# Altium schematic sheet MPU_12x12.SchDoc: MPU_12x12
size A3; DocumentNumber: MB1272; Revision: A-01; SheetNumber: 3; SheetTotal: 15; Project: STM32MP15-DISCO PI; ProjectName: MB1272
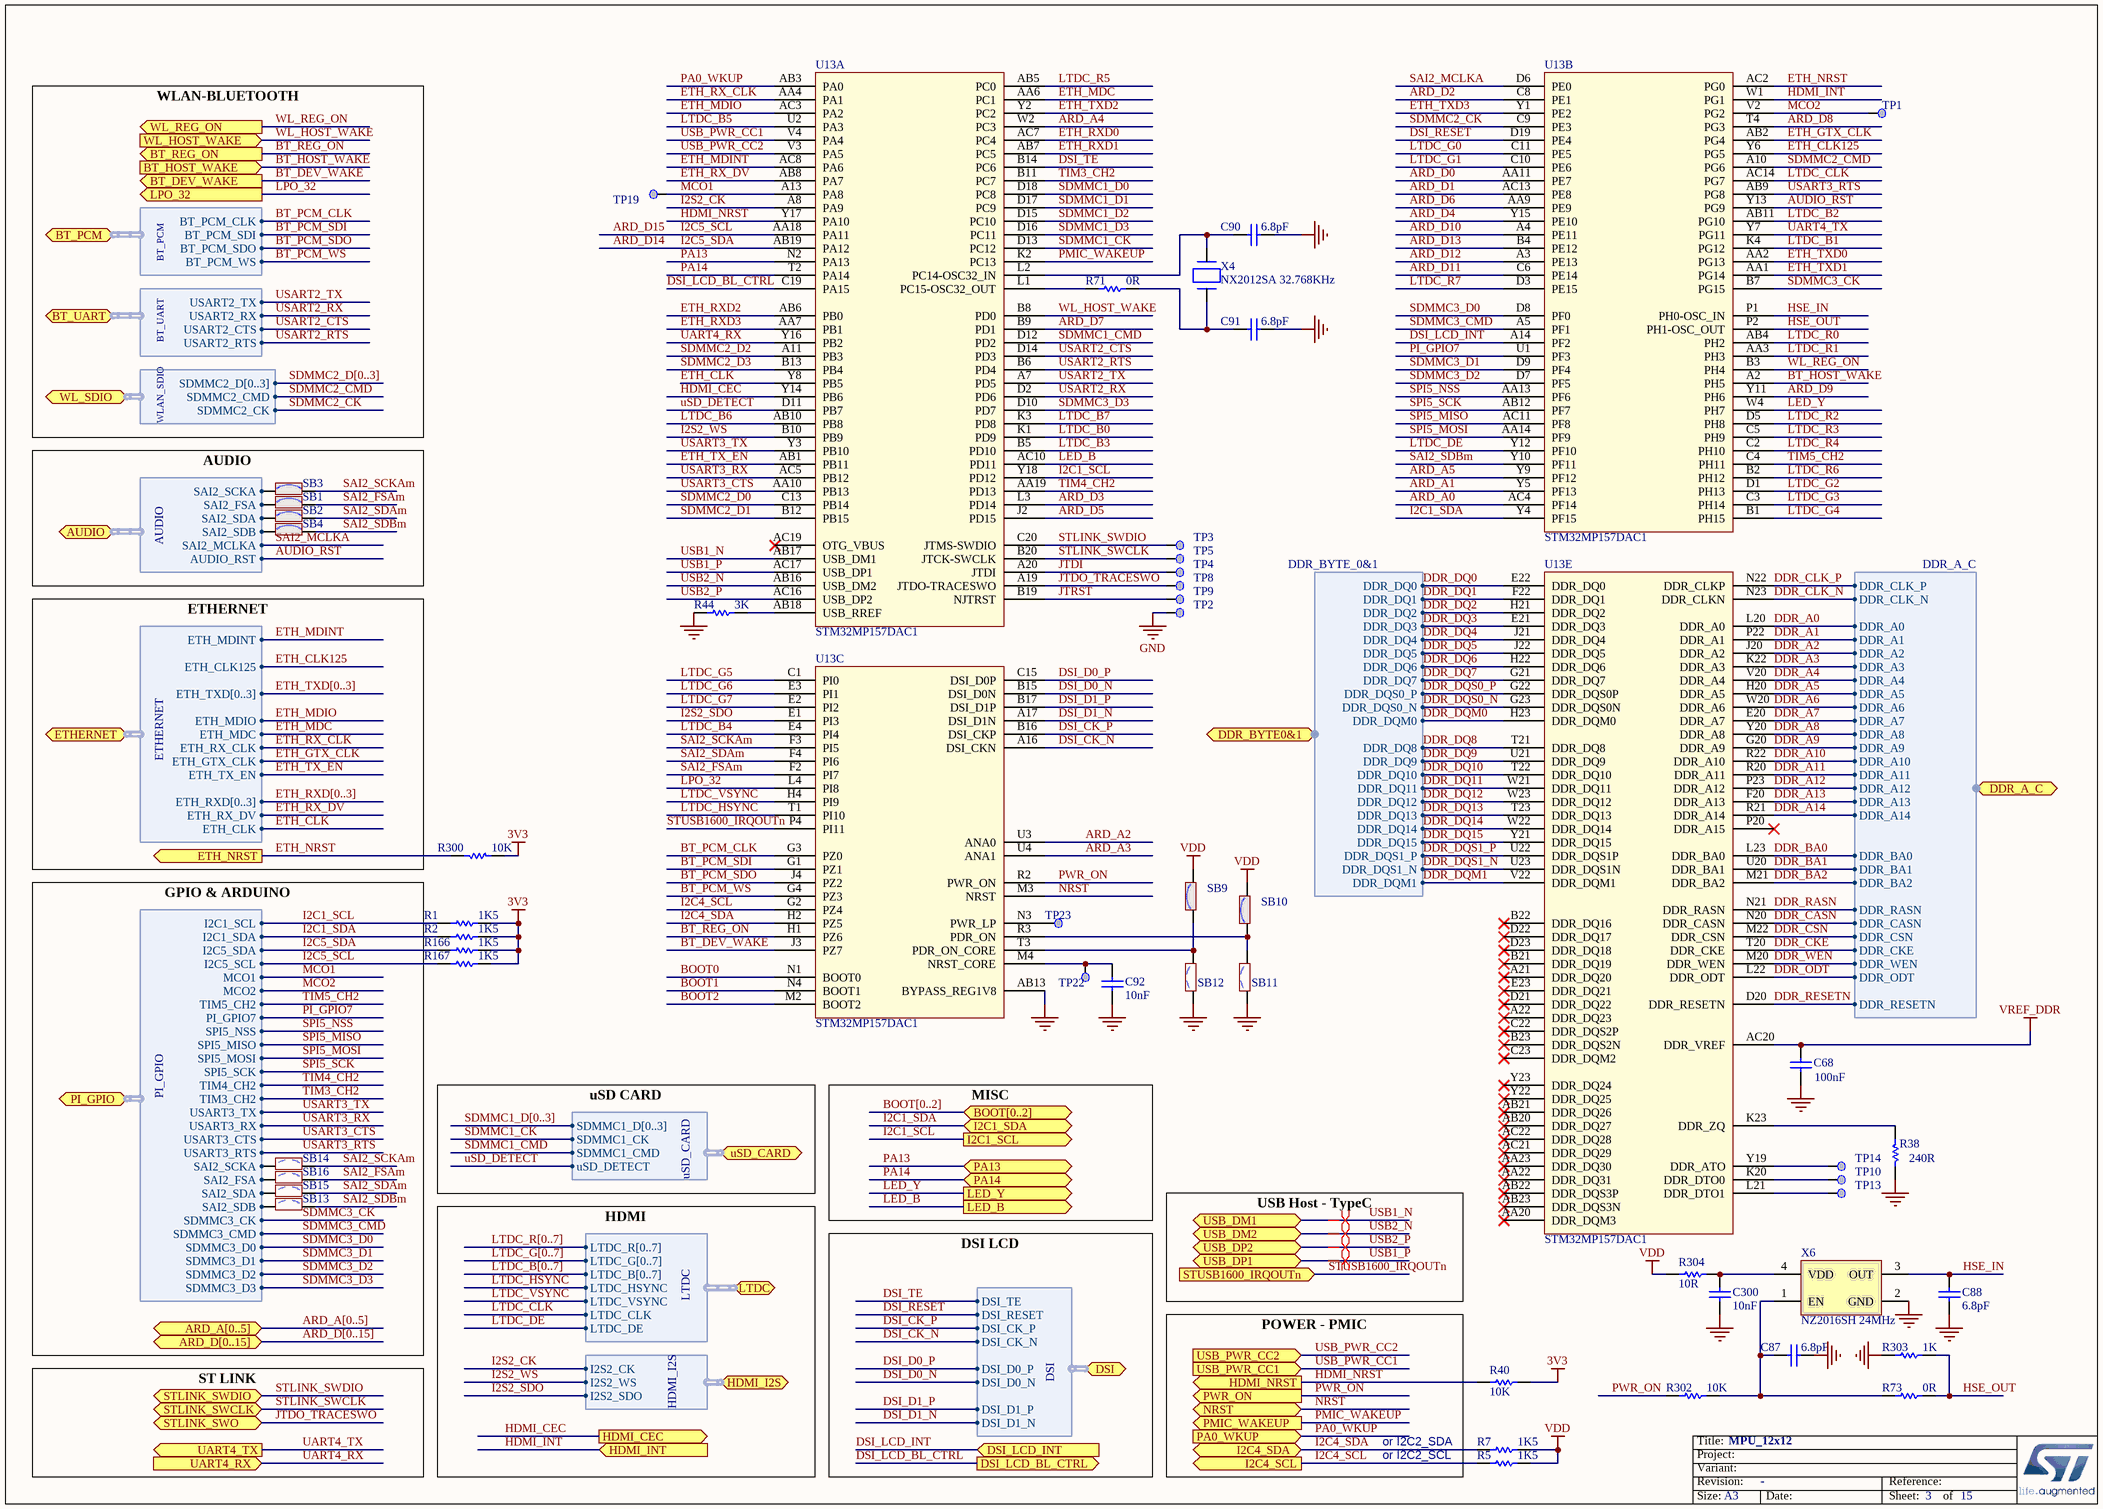
[diagram p0: MPU_12x12.SchDoc]

## Parts
C68  value 100nF  [C0402]
C87  value 6.8pF  [C0402]  (hidden comment: Capacitor)
C88  value 6.8pF  [C0402]  (hidden comment: Capacitor)
C90  value 6.8pF  [C0402]  (hidden comment: Capacitor)
C91  value 6.8pF  [C0402]  (hidden comment: Capacitor)
C92  value 10nF  [C0402]  (hidden comment: Capacitor)
C300  value 10nF  [C0402]  (hidden comment: Capacitor)
R1  value 1K5  [R0402]
R2  value 1K5  [R0402]
R5  value 1K5  [R0402]
R7  value 1K5  [R0402]
R38  value 240R  [R0402]
R40  value 10K  [R0402]  (hidden comment: Resistor)
R44  value 3K  [R0402]
R71  value 0R  [R0402]
R73  value 0R  [R0402]
R166  value 1K5  [R0402]
R167  value 1K5  [R0402]
R300  value 10K  [R0402]  (hidden comment: Resistor)
R302  value 10K  [R0402]  (hidden comment: Resistor)
R303  value 1K  [R0402]
R304  value 10R  [R0402]  (hidden comment: Resistor)
SB1  (no value)  [SOLDER-BRIDGE_R0603-0R]
SB2  (no value)  [SOLDER-BRIDGE_R0603-0R]
SB3  (no value)  [SOLDER-BRIDGE_R0603-0R]
SB4  (no value)  [SOLDER-BRIDGE_R0603-0R]
SB9  (no value)  [SOLDER-BRIDGE_R0603-0R]
SB10  (no value)  [SOLDER-BRIDGE_R0603-0R]
SB11  (no value)  [SOLDER-BRIDGE_R0603-0R]
SB12  (no value)  [SOLDER-BRIDGE_R0603-0R]
SB13  (no value)  [SOLDER-BRIDGE_R0603-0R]
SB14  (no value)  [SOLDER-BRIDGE_R0603-0R]
SB15  (no value)  [SOLDER-BRIDGE_R0603-0R]
SB16  (no value)  [SOLDER-BRIDGE_R0603-0R]
TP1  Test Point  [TP_SMD_1MM]  (value not drawn)  (no BOM)
TP2  Test Point  [TP_SMD_1MM]  (value not drawn)  (no BOM)
TP3  Test Point  [TP_SMD_1MM]  (value not drawn)  (no BOM)
TP4  Test Point  [TP_SMD_1MM]  (value not drawn)  (no BOM)
TP5  Test Point  [TP_SMD_1MM]  (value not drawn)  (no BOM)
TP8  Test Point  [TP_SMD_1MM]  (value not drawn)  (no BOM)
TP9  Test Point  [TP_SMD_1MM]  (value not drawn)  (no BOM)
TP10  (no value)  [TP_SMD_0-6MM]
TP13  (no value)  [TP_SMD_0-6MM]
TP14  (no value)  [TP_SMD_0-6MM]
TP19  Test Point  [TP_SMD_1MM]  (value not drawn)  (no BOM)
TP22  Test Point  [TP_SMD_1MM]  (value not drawn)  (no BOM)
TP23  Test Point  [TP_SMD_1MM]  (value not drawn)  (no BOM)
U13  value STM32MP157DAC1  [ICC_TFBGA361_12X12_STM32MP157CAC3_P050-065]  (parts A,B,C,E of 5)
X4  value NX2012SA 32.768KHz  [CRY_NX2012SA_2P]  (hidden comment: XTAL_2_PINS)
X6  value NZ2016SH 24MHz  [CRY_NZ2016SH_4P]  (hidden comment: OSCILLATOR_4_PINS)

## Ports
ARD_A[0..5], ARD_D[0..15], AUDIO (harness AUDIO), BOOT[0..2], BT_DEV_WAKE (out), BT_HOST_WAKE (in), BT_PCM (harness BT_PCM), BT_REG_ON (out), BT_UART (harness BT_UART), DDR_A_C (harness DDR_A_C), DDR_BYTE0&1 (harness DDR_BYTE_0&1), DSI (harness DSI), DSI_LCD_BL_CTRL (out), DSI_LCD_INT (in), ETH_NRST (out), ETHERNET (harness ETHERNET), HDMI_CEC (out), HDMI_I2S (harness HDMI_I2S), HDMI_INT (in), HDMI_NRST (out), I2C1_SCL (out), I2C1_SDA (bidir), I2C4_SCL (out), I2C4_SDA (bidir), LED_B (out), LED_Y (out), LPO_32 (out), LTDC (harness LTDC), NRST (bidir), PA0_WKUP (in), PA13, PA14, PI_GPIO (harness PI_GPIO), PMIC_WAKEUP (out), PWR_ON (out), STLINK_SWCLK, STLINK_SWDIO, STLINK_SWO, STUSB1600_IRQOUTn (in), UART4_RX (in), UART4_TX (out), USB_DM1 (bidir), USB_DM2 (bidir), USB_DP1 (bidir), USB_DP2 (bidir), USB_PWR_CC1 (in), USB_PWR_CC2 (in), uSD_CARD (harness uSD_CARD), WL_HOST_WAKE (in), WL_REG_ON (out), WL_SDIO (harness WLAN_SDIO)

## Harnesses
DDR_BYTE_0&1: DDR_DQ0, DDR_DQ1, DDR_DQ2, DDR_DQ3, DDR_DQ4, DDR_DQ5, DDR_DQ6, DDR_DQ7, DDR_DQS0_P, DDR_DQS0_N, DDR_DQM0, DDR_DQ8, DDR_DQ9, DDR_DQ10, DDR_DQ11, DDR_DQ12, DDR_DQ13, DDR_DQ14, DDR_DQ15, DDR_DQS1_P, DDR_DQS1_N, DDR_DQM1
DDR_A_C: DDR_CLK_P, DDR_CLK_N, DDR_A0, DDR_A1, DDR_A2, DDR_A3, DDR_A4, DDR_A5, DDR_A6, DDR_A7, DDR_A8, DDR_A9, DDR_A10, DDR_A11, DDR_A12, DDR_A13, DDR_A14, DDR_BA0, DDR_BA1, DDR_BA2, DDR_RASN, DDR_CASN, DDR_CSN, DDR_CKE, DDR_WEN, DDR_ODT, DDR_RESETN
PI_GPIO: I2C1_SCL, I2C1_SDA, I2C5_SDA, MCO1, MCO2, TIM5_CH2, PI_GPIO7, SPI5_NSS, SPI5_MISO, SPI5_MOSI, SPI5_SCK, TIM4_CH2, TIM3_CH2, USART3_TX, USART3_RX, USART3_CTS, USART3_RTS, SDMMC3_CK, SDMMC3_CMD, SDMMC3_D0, SDMMC3_D1, SDMMC3_D2, SDMMC3_D3, I2C5_SCL, SAI2_SCKA, SAI2_FSA, SAI2_SDA, SAI2_SDB
ETHERNET: ETH_MDINT, ETH_CLK125, ETH_TXD[0..3], ETH_MDIO, ETH_MDC, ETH_RX_CLK, ETH_GTX_CLK, ETH_TX_EN, ETH_RXD[0..3], ETH_RX_DV, ETH_CLK
AUDIO: SAI2_SCKA, SAI2_FSA, SAI2_SDA, SAI2_SDB, SAI2_MCLKA, AUDIO_RST
LTDC: LTDC_R[0..7], LTDC_G[0..7], LTDC_B[0..7], LTDC_HSYNC, LTDC_VSYNC, LTDC_CLK, LTDC_DE
uSD_CARD: SDMMC1_D[0..3], SDMMC1_CK, SDMMC1_CMD, uSD_DETECT
BT_PCM: BT_PCM_CLK, BT_PCM_SDI, BT_PCM_SDO, BT_PCM_WS
BT_UART: USART2_TX, USART2_RX, USART2_CTS, USART2_RTS
WLAN_SDIO: SDMMC2_D[0..3], SDMMC2_CMD, SDMMC2_CK
HDMI_I2S: I2S2_CK, I2S2_SDO, I2S2_WS
DSI: DSI_CK_P, DSI_CK_N, DSI_D0_P, DSI_D0_N, DSI_D1_P, DSI_D1_N, DSI_TE, DSI_RESET

## Nets
3V3: R1.1 R2.1 R40.1 R166.1 R167.1 R300.1
GND: C68.1 C87.2 C88.1 C90.2 C91.2 C92.1 C300.1 R38.2 R44.1 R303.2 SB11.1 SB12.1 TP2.1 U13.AB13(BYPASS_REG1V8) X6.2(GND)
VDD: R5.1 R7.1 R304.1 SB9.2 SB10.2
VREF_DDR: C68.2 U13.AC20(DDR_VREF)
ARD_A0: U13.AC4(PF14)
ARD_A1: U13.Y5(PF13)
ARD_A2: U13.U3(ANA0)
ARD_A3: U13.U4(ANA1)
ARD_A4: U13.W2(PC3)
ARD_A5: U13.Y9(PF12)
ARD_D0: U13.AA11(PE7)
ARD_D1: U13.AC13(PE8)
ARD_D2: U13.C8(PE1)
ARD_D3: U13.L3(PD14)
ARD_D4: U13.Y15(PE10)
ARD_D5: U13.J2(PD15)
ARD_D6: U13.AA9(PE9)
ARD_D7: U13.B9(PD1)
ARD_D8: U13.T4(PG3)
ARD_D9: U13.Y11(PH6)
ARD_D10: U13.A4(PE11)
ARD_D11: U13.C6(PE14)
ARD_D12: U13.A3(PE13)
ARD_D13: U13.B4(PE12)
ARD_D14: R166.2 U13.AB19(PA12) ; port PI_GPIO.I2C5_SDA  [also labelled I2C5_SDA]
ARD_D15: R167.2 U13.AA18(PA11) ; port PI_GPIO.I2C5_SCL  [also labelled I2C5_SCL]
AUDIO_RST: U13.Y13(PG9) ; port AUDIO.AUDIO_RST
BOOT0: U13.N1(BOOT0)
BOOT1: U13.N4(BOOT1)
BOOT2: U13.M2(BOOT2)
BT_DEV_WAKE: U13.J3(PZ7) ; port BT_DEV_WAKE
BT_HOST_WAKE: U13.A2(PH5) ; port BT_HOST_WAKE
BT_PCM_CLK: U13.G3(PZ0) ; port BT_PCM.BT_PCM_CLK
BT_PCM_SDI: U13.G1(PZ1) ; port BT_PCM.BT_PCM_SDI
BT_PCM_SDO: U13.J4(PZ2) ; port BT_PCM.BT_PCM_SDO
BT_PCM_WS: U13.G4(PZ3) ; port BT_PCM.BT_PCM_WS
BT_REG_ON: U13.H1(PZ6) ; port BT_REG_ON
DDR_A0: U13.L20(DDR_A0) ; port DDR_A_C.DDR_A0
DDR_A1: U13.P22(DDR_A1) ; port DDR_A_C.DDR_A1
DDR_A2: U13.J20(DDR_A2) ; port DDR_A_C.DDR_A2
DDR_A3: U13.K22(DDR_A3) ; port DDR_A_C.DDR_A3
DDR_A4: U13.V20(DDR_A4) ; port DDR_A_C.DDR_A4
DDR_A5: U13.H20(DDR_A5) ; port DDR_A_C.DDR_A5
DDR_A6: U13.W20(DDR_A6) ; port DDR_A_C.DDR_A6
DDR_A7: U13.E20(DDR_A7) ; port DDR_A_C.DDR_A7
DDR_A8: U13.Y20(DDR_A8) ; port DDR_A_C.DDR_A8
DDR_A9: U13.G20(DDR_A9) ; port DDR_A_C.DDR_A9
DDR_A10: U13.R22(DDR_A10) ; port DDR_A_C.DDR_A10
DDR_A11: U13.R20(DDR_A11) ; port DDR_A_C.DDR_A11
DDR_A12: U13.P23(DDR_A12) ; port DDR_A_C.DDR_A12
DDR_A13: U13.F20(DDR_A13) ; port DDR_A_C.DDR_A13
DDR_A14: U13.R21(DDR_A14) ; port DDR_A_C.DDR_A14
DDR_BA0: U13.L23(DDR_BA0) ; port DDR_A_C.DDR_BA0
DDR_BA1: U13.U20(DDR_BA1) ; port DDR_A_C.DDR_BA1
DDR_BA2: U13.M21(DDR_BA2) ; port DDR_A_C.DDR_BA2
DDR_CASN: U13.N20(DDR_CASN) ; port DDR_A_C.DDR_CASN
DDR_CKE: U13.T20(DDR_CKE) ; port DDR_A_C.DDR_CKE
DDR_CLK_N: U13.N23(DDR_CLKN) ; port DDR_A_C.DDR_CLK_N
DDR_CLK_P: U13.N22(DDR_CLKP) ; port DDR_A_C.DDR_CLK_P
DDR_CSN: U13.M22(DDR_CSN) ; port DDR_A_C.DDR_CSN
DDR_DQ0: U13.E22(DDR_DQ0) ; port DDR_BYTE0&1.DDR_DQ0
DDR_DQ1: U13.F22(DDR_DQ1) ; port DDR_BYTE0&1.DDR_DQ1
DDR_DQ2: U13.H21(DDR_DQ2) ; port DDR_BYTE0&1.DDR_DQ2
DDR_DQ3: U13.E21(DDR_DQ3) ; port DDR_BYTE0&1.DDR_DQ3
DDR_DQ4: U13.J21(DDR_DQ4) ; port DDR_BYTE0&1.DDR_DQ4
DDR_DQ5: U13.J22(DDR_DQ5) ; port DDR_BYTE0&1.DDR_DQ5
DDR_DQ6: U13.H22(DDR_DQ6) ; port DDR_BYTE0&1.DDR_DQ6
DDR_DQ7: U13.G21(DDR_DQ7) ; port DDR_BYTE0&1.DDR_DQ7
DDR_DQ8: U13.T21(DDR_DQ8) ; port DDR_BYTE0&1.DDR_DQ8
DDR_DQ9: U13.U21(DDR_DQ9) ; port DDR_BYTE0&1.DDR_DQ9
DDR_DQ10: U13.T22(DDR_DQ10) ; port DDR_BYTE0&1.DDR_DQ10
DDR_DQ11: U13.W21(DDR_DQ11) ; port DDR_BYTE0&1.DDR_DQ11
DDR_DQ12: U13.W23(DDR_DQ12) ; port DDR_BYTE0&1.DDR_DQ12
DDR_DQ13: U13.T23(DDR_DQ13) ; port DDR_BYTE0&1.DDR_DQ13
DDR_DQ14: U13.W22(DDR_DQ14) ; port DDR_BYTE0&1.DDR_DQ14
DDR_DQ15: U13.Y21(DDR_DQ15) ; port DDR_BYTE0&1.DDR_DQ15
DDR_DQM0: U13.H23(DDR_DQM0) ; port DDR_BYTE0&1.DDR_DQM0
DDR_DQM1: U13.V22(DDR_DQM1) ; port DDR_BYTE0&1.DDR_DQM1
DDR_DQS0_N: U13.G23(DDR_DQS0N) ; port DDR_BYTE0&1.DDR_DQS0_N
DDR_DQS0_P: U13.G22(DDR_DQS0P) ; port DDR_BYTE0&1.DDR_DQS0_P
DDR_DQS1_N: U13.U23(DDR_DQS1N) ; port DDR_BYTE0&1.DDR_DQS1_N
DDR_DQS1_P: U13.U22(DDR_DQS1P) ; port DDR_BYTE0&1.DDR_DQS1_P
DDR_ODT: U13.L22(DDR_ODT) ; port DDR_A_C.DDR_ODT
DDR_RASN: U13.N21(DDR_RASN) ; port DDR_A_C.DDR_RASN
DDR_RESETN: U13.D20(DDR_RESETN) ; port DDR_A_C.DDR_RESETN
DDR_WEN: U13.M20(DDR_WEN) ; port DDR_A_C.DDR_WEN
DSI_CK_N: U13.A16(DSI_CKN) ; port DSI.DSI_CK_N
DSI_CK_P: U13.B16(DSI_CKP) ; port DSI.DSI_CK_P
DSI_D0_N: U13.B15(DSI_D0N) ; port DSI.DSI_D0_N
DSI_D0_P: U13.C15(DSI_D0P) ; port DSI.DSI_D0_P
DSI_D1_N: U13.A17(DSI_D1N) ; port DSI.DSI_D1_N
DSI_D1_P: U13.B17(DSI_D1P) ; port DSI.DSI_D1_P
DSI_LCD_BL_CTRL: U13.C19(PA15) ; port DSI_LCD_BL_CTRL
DSI_LCD_INT: U13.A14(PF2) ; port DSI_LCD_INT
DSI_RESET: U13.D19(PE4) ; port DSI.DSI_RESET
DSI_TE: U13.B14(PC6) ; port DSI.DSI_TE
ETH_CLK: U13.Y8(PB5) ; port ETHERNET.ETH_CLK
ETH_CLK125: U13.Y6(PG5) ; port ETHERNET.ETH_CLK125
ETH_GTX_CLK: U13.AB2(PG4) ; port ETHERNET.ETH_GTX_CLK
ETH_MDC: U13.AA6(PC1) ; port ETHERNET.ETH_MDC
ETH_MDINT: U13.AC8(PA6) ; port ETHERNET.ETH_MDINT
ETH_MDIO: U13.AC3(PA2) ; port ETHERNET.ETH_MDIO
ETH_NRST: R300.2 U13.AC2(PG0) ; port ETH_NRST
ETH_RX_CLK: U13.AA4(PA1) ; port ETHERNET.ETH_RX_CLK
ETH_RX_DV: U13.AB8(PA7) ; port ETHERNET.ETH_RX_DV
ETH_RXD0: U13.AC7(PC4)
ETH_RXD1: U13.AB7(PC5)
ETH_RXD2: U13.AB6(PB0)
ETH_RXD3: U13.AA7(PB1)
ETH_TX_EN: U13.AB1(PB11) ; port ETHERNET.ETH_TX_EN
ETH_TXD0: U13.AA2(PG13)
ETH_TXD1: U13.AA1(PG14)
ETH_TXD2: U13.Y2(PC2)
ETH_TXD3: U13.Y1(PE2)
HDMI_CEC: U13.Y14(PB6) ; port HDMI_CEC
HDMI_INT: U13.W1(PG1) ; port HDMI_INT
HDMI_NRST: R40.2 U13.Y17(PA10) ; port HDMI_NRST
HSE_IN: C88.2 U13.P1(PH0-OSC_IN) X6.3(OUT)
HSE_OUT: R73.2 R303.1 U13.P2(PH1-OSC_OUT)
I2C1_SCL: R1.2 U13.Y18(PD12) ; port I2C1_SCL, port PI_GPIO.I2C1_SCL
I2C1_SDA: R2.2 U13.Y4(PF15) ; port I2C1_SDA, port PI_GPIO.I2C1_SDA
I2C4_SCL: R5.2 U13.G2(PZ4) ; port I2C4_SCL
I2C4_SDA: R7.2 U13.H2(PZ5) ; port I2C4_SDA
I2S2_CK: U13.A8(PA9) ; port HDMI_I2S.I2S2_CK
I2S2_SDO: U13.E1(PI3) ; port HDMI_I2S.I2S2_SDO
I2S2_WS: U13.B10(PB9) ; port HDMI_I2S.I2S2_WS
JTDI: TP4.1 U13.A20(JTDI)
JTDO_TRACESWO: TP8.1 U13.A19(JTDO-TRACESWO) ; port STLINK_SWO
JTRST: TP9.1 U13.B19(NJTRST)
LED_B: U13.AC10(PD11) ; port LED_B
LED_Y: U13.W4(PH7) ; port LED_Y
LPO_32: U13.L4(PI8) ; port LPO_32
LTDC_B0: U13.K1(PD9)
LTDC_B1: U13.K4(PG12)
LTDC_B2: U13.AB11(PG10)
LTDC_B3: U13.B5(PD10)
LTDC_B4: U13.E4(PI4)
LTDC_B5: U13.U2(PA3)
LTDC_B6: U13.AB10(PB8)
LTDC_B7: U13.K3(PD8)
LTDC_CLK: U13.AC14(PG7) ; port LTDC.LTDC_CLK
LTDC_DE: U13.Y12(PF10) ; port LTDC.LTDC_DE
LTDC_G0: U13.C11(PE5)
LTDC_G1: U13.C10(PE6)
LTDC_G2: U13.D1(PH13)
LTDC_G3: U13.C3(PH14)
LTDC_G4: U13.B1(PH15)
LTDC_G5: U13.C1(PI0)
LTDC_G6: U13.E3(PI1)
LTDC_G7: U13.E2(PI2)
LTDC_HSYNC: U13.T1(PI10) ; port LTDC.LTDC_HSYNC
LTDC_R0: U13.AB4(PH2)
LTDC_R1: U13.AA3(PH3)
LTDC_R2: U13.D5(PH8)
LTDC_R3: U13.C5(PH9)
LTDC_R4: U13.C2(PH10)
LTDC_R5: U13.AB5(PC0)
LTDC_R6: U13.B2(PH12)
LTDC_R7: U13.D3(PE15)
LTDC_VSYNC: U13.H4(PI9) ; port LTDC.LTDC_VSYNC
MCO1: TP19.1 U13.A13(PA8) ; port PI_GPIO.MCO1
MCO2: TP1.1 U13.V2(PG2) ; port PI_GPIO.MCO2
NRST: U13.M3(NRST) ; port NRST
PA0_WKUP: U13.AB3(PA0) ; port PA0_WKUP
PA13: U13.N2(PA13) ; port PA13
PA14: U13.T2(PA14) ; port PA14
PI_GPIO7: U13.U1(PF3) ; port PI_GPIO.PI_GPIO7
PMIC_WAKEUP: U13.K2(PC13) ; port PMIC_WAKEUP
PWR_ON: R302.2 U13.R2(PWR_ON) ; port PWR_ON
SAI2_FSAm: SB1.2 SB16.2 U13.F2(PI7)
SAI2_MCLKA: U13.D6(PE0) ; port AUDIO.SAI2_MCLKA
SAI2_SCKAm: SB3.2 SB14.2 U13.F3(PI5)
SAI2_SDAm: SB2.2 SB15.2 U13.F4(PI6)
SAI2_SDBm: SB4.2 SB13.2 U13.Y10(PF11)
SDMMC1_CK: U13.D13(PC12) ; port uSD_CARD.SDMMC1_CK
SDMMC1_CMD: U13.D12(PD2) ; port uSD_CARD.SDMMC1_CMD
SDMMC1_D0: U13.D18(PC8)
SDMMC1_D1: U13.D17(PC9)
SDMMC1_D2: U13.D15(PC10)
SDMMC1_D3: U13.D16(PC11)
SDMMC2_CK: U13.C9(PE3) ; port WL_SDIO.SDMMC2_CK
SDMMC2_CMD: U13.A10(PG6) ; port WL_SDIO.SDMMC2_CMD
SDMMC2_D0: U13.C13(PB14)
SDMMC2_D1: U13.B12(PB15)
SDMMC2_D2: U13.A11(PB3)
SDMMC2_D3: U13.B13(PB4)
SDMMC3_CK: U13.B7(PG15) ; port PI_GPIO.SDMMC3_CK
SDMMC3_CMD: U13.A5(PF1) ; port PI_GPIO.SDMMC3_CMD
SDMMC3_D0: U13.D8(PF0) ; port PI_GPIO.SDMMC3_D0
SDMMC3_D1: U13.D9(PF4) ; port PI_GPIO.SDMMC3_D1
SDMMC3_D2: U13.D7(PF5) ; port PI_GPIO.SDMMC3_D2
SDMMC3_D3: U13.D10(PD7) ; port PI_GPIO.SDMMC3_D3
SPI5_MISO: U13.AC11(PF8) ; port PI_GPIO.SPI5_MISO
SPI5_MOSI: U13.AA14(PF9) ; port PI_GPIO.SPI5_MOSI
SPI5_NSS: U13.AA13(PF6) ; port PI_GPIO.SPI5_NSS
SPI5_SCK: U13.AB12(PF7) ; port PI_GPIO.SPI5_SCK
STLINK_SWCLK: TP5.1 U13.B20(JTCK-SWCLK) ; port STLINK_SWCLK
STLINK_SWDIO: TP3.1 U13.C20(JTMS-SWDIO) ; port STLINK_SWDIO
STUSB1600_IRQOUTn: U13.P4(PI11) ; port STUSB1600_IRQOUTn
TIM3_CH2: U13.B11(PC7) ; port PI_GPIO.TIM3_CH2
TIM4_CH2: U13.AA19(PD13) ; port PI_GPIO.TIM4_CH2
TIM5_CH2: U13.C4(PH11) ; port PI_GPIO.TIM5_CH2
UART4_RX: U13.Y16(PB2) ; port UART4_RX
UART4_TX: U13.Y7(PG11) ; port UART4_TX
USART2_CTS: U13.D14(PD3) ; port BT_UART.USART2_CTS
USART2_RTS: U13.B6(PD4) ; port BT_UART.USART2_RTS
USART2_RX: U13.D2(PD6) ; port BT_UART.USART2_RX
USART2_TX: U13.A7(PD5) ; port BT_UART.USART2_TX
USART3_CTS: U13.AA10(PB13) ; port PI_GPIO.USART3_CTS
USART3_RTS: U13.AB9(PG8) ; port PI_GPIO.USART3_RTS
USART3_RX: U13.AC5(PB12) ; port PI_GPIO.USART3_RX
USART3_TX: U13.Y3(PB10) ; port PI_GPIO.USART3_TX
USB1_N: U13.AB17(USB_DM1) ; port USB_DM1
USB1_P: U13.AC17(USB_DP1) ; port USB_DP1
USB2_N: U13.AB16(USB_DM2) ; port USB_DM2
USB2_P: U13.AC16(USB_DP2) ; port USB_DP2
USB_PWR_CC1: U13.V4(PA4) ; port USB_PWR_CC1
USB_PWR_CC2: U13.V3(PA5) ; port USB_PWR_CC2
uSD_DETECT: U13.D11(PB7) ; port uSD_CARD.uSD_DETECT
WL_HOST_WAKE: U13.B8(PD0) ; port WL_HOST_WAKE
WL_REG_ON: U13.B3(PH4) ; port WL_REG_ON
NetC87_1: C87.1 R73.1 R302.1 X6.1(EN)
NetC90_1: C90.1 U13.L2(PC14-OSC32_IN) X4.2(X2)
NetC91_1: C91.1 R71.2 X4.1(X1)
NetC92_2: C92.2 TP22.1 U13.M4(NRST_CORE)
NetC300_2: C300.2 R304.2 X6.4(VDD)
NetR38_1: R38.1 U13.K23(DDR_ZQ)
NetR44_2: R44.2 U13.AB18(USB_RREF)
NetR71_1: R71.1 U13.L1(PC15-OSC32_OUT)
NetSB1_1: SB1.1 ; port AUDIO.SAI2_FSA
NetSB2_1: SB2.1 ; port AUDIO.SAI2_SDA
NetSB3_1: SB3.1 ; port AUDIO.SAI2_SCKA
NetSB4_1: SB4.1 ; port AUDIO.SAI2_SDB
NetSB9_1: SB9.1 SB12.2 U13.T3(PDR_ON_CORE)
NetSB10_1: SB10.1 SB11.2 U13.R3(PDR_ON)
NetSB13_1: SB13.1 ; port PI_GPIO.SAI2_SDB
NetSB14_1: SB14.1 ; port PI_GPIO.SAI2_SCKA
NetSB15_1: SB15.1 ; port PI_GPIO.SAI2_SDA
NetSB16_1: SB16.1 ; port PI_GPIO.SAI2_FSA
NetTP10_1: TP10.1 U13.K20(DDR_DTO0)
NetTP13_1: TP13.1 U13.L21(DDR_DTO1)
NetTP14_1: TP14.1 U13.Y19(DDR_ATO)
NetTP23_1: TP23.1 U13.N3(PWR_LP)

Not connected (* = marked no-connect by the designer): U13 A21(DDR_DQ20)* A22(DDR_DQ23)* AA20(DDR_DQM3)* AA22(DDR_DQ31)* AA23(DDR_DQ30)* AB20(DDR_DQ27)* AB21(DDR_DQ26)* AB22(DDR_DQS3P)* AB23(DDR_DQS3N)* AC19(OTG_VBUS)* AC21(DDR_DQ29)* AC22(DDR_DQ28)* B21(DDR_DQ19)* B22(DDR_DQ16)* B23(DDR_DQS2N)* C22(DDR_DQS2P)* C23(DDR_DQM2)* D21(DDR_DQ22)* D22(DDR_DQ17)* D23(DDR_DQ18)* E23(DDR_DQ21)* P20(DDR_A15)* Y22(DDR_DQ25)* Y23(DDR_DQ24)*

## Buses and harness runs
bus ARD_A[0..5] = port ARD_A[0..5]
bus ARD_D[0..15] = port ARD_D[0..15]
bus BOOT[0..2] = port BOOT[0..2]
bus ETH_RXD[0..3]
bus ETH_TXD[0..3]
bus LTDC_B[0..7]
bus LTDC_G[0..7]
bus LTDC_R[0..7]
bus SDMMC1_D[0..3]
bus SDMMC2_D[0..3]

## Layout directives
differential pair: USB1_N, USB1_P, USB2_N, USB2_P

## Notes on the sheet
- WLAN-BLUETOOTH
- AUDIO
- ETHERNET
- uSD CARD
- MISC
- USB Host - TypeC
- GPIO & ARDUINO
- or I2C2_SDA
- or I2C2_SCL
- ST LINK
- HDMI
- DSI LCD
- POWER - PMIC
- Title:
- Project:
- Size:
- Revision:
- Variant:
- A3
- -
- Date:
- Reference:
- Sheet:
- of

## Library data of the parts
C68 = MCD-00006: Capacitor,100nF,16V,X7R,10%,0402; Manufacturer_Part_Number: CC0402KRX7R7BB104; Manufacturer: YAGEO; Alternate_Manufacturer: MURATA; Alternate_Manufacturer_Part_Number: GCM155R71C104KA55D; Provided_By: SUBCO; Initial_Board_Reference: mb1274; Internal_Part_Number: MCD-00006; ComponentLink1Description: Datasheet; ECCN_US: n/a; ECCN_EU: n/a; Status: Released; Part_Type: Capacitor; Package: C0402; ComponentLink1URL: http://tunmcdsvn.tun.st.com/Component_Datasheet_Library/Trunk/Capacitors/Yageo_Multilayer_Capacitor_X7R_series_100pF_to_22uF
C87 C88 = MCD-00674: Capacitor, MLCC, 6.8pF, 50V, NPO, +-0.25pF, 0402, T=0.5mm; Manufacturer_Part_Number: CC0402CRNPO9BN6R8; Manufacturer: YAGEO; Provided_By: SUBCO; Initial_Board_Reference: MB1319; Internal_Part_Number: MCD-00674; Status: Released; Part_Type: Capacitor; Package: C0402; ComponentLink1Description: Datasheet; ComponentLink1URL: http://tunmcdsvn.tun.st.com/Component_Datasheet_Library/Trunk/Capacitors/Yageo_Capacitor_NP0_16V-to-50V; ECCN_US: n/a; ECCN_EU: n/a
C90 C91 = MCD-00674: Capacitor, MLCC, 6.8pF, 50V, NPO, +-0.25pF, 0402, T=0.5mm; Manufacturer_Part_Number: CC0402CRNPO9BN6R8; Manufacturer: YAGEO; Provided_By: SUBCO; Initial_Board_Reference: MB1319; Path: ws/MCD_ApplicationBoards/Lists/MCDPARTSdatabase; Item Type: Item; Internal_Part_Number: MCD-00674; Status: Released; Part_Type: Capacitor; Package: C0402; ComponentLink1Description: Datasheet; ComponentLink1URL: http://tunmcdsvn.tun.st.com/Component_Datasheet_Library/Trunk/Capacitors/Yageo_Capacitor_NP0_16V-to-50V
C92 C300 = MCD-00011: Capacitor, MLCC, 10nF, 16V, X7R, 10%, 0402, T=0.5mm; Manufacturer_Part_Number: CC0402KRX7R7BB103; Manufacturer: YAGEO; Provided_By: SUBCO; Initial_Board_Reference: MB1274; Internal_Part_Number: MCD-00011; Status: Released; Part_Type: Capacitor; Package: C0402; ComponentLink1Description: Datasheet; ComponentLink1URL: http://tunmcdsvn.tun.st.com/Component_Datasheet_Library/Trunk/Capacitors/Yageo_Multilayer_Capacitor_X7R_series_100pF_to_22uF; ECCN_US: n/a; ECCN_EU: n/a
R1 R2 R5 R7 R166 R167 = MCD-00068: Resistor,1K5,0402,1%,1/16W; Manufacturer_Part_Number: RC0402FR-071K5L; Manufacturer: YAGEO; Provided_By: SUBCO; Initial_Board_Reference: mb1274; Internal_Part_Number: MCD-00068; ComponentLink1Description: Datasheet; ECCN_US: n/a; ECCN_EU: n/a; Status: Released; Part_Type: Resistor; ComponentLink1URL: http://tunmcdsvn.tun.st.com/Component_Datasheet_Library/Trunk/Resistors/Yageo_Resistor_RC0402-series; Package: R0402
R38 = MCD-00120: Resistor,240R,0402,1%,1/16W; Manufacturer_Part_Number: RC0402FR-07240RL; Manufacturer: YAGEO; Provided_By: SUBCO; Initial_Board_Reference: mb1262; Internal_Part_Number: MCD-00120; ComponentLink1Description: Datasheet; Status: Released; Part_Type: Resistor; ECCN_US: n/a; ECCN_EU: n/a; ComponentLink1URL: http://tunmcdsvn.tun.st.com/Component_Datasheet_Library/Trunk/Resistors/Yageo_Resistor_RC0402-series; Package: R0402
R40 R300 R302 = MCD-00053: Resistor,10K,0402,1%,1/16W; Manufacturer_Part_Number: RC0402FR-0710KL; Manufacturer: YAGEO; Provided_By: SUBCO; Initial_Board_Reference: MB1274; Internal_Part_Number: MCD-00053; ComponentLink1Description: Datasheet; ECCN_US: n/a; ECCN_EU: n/a; Status: Released; Part_Type: Resistor; ComponentLink1URL: http://tunmcdsvn.tun.st.com/Component_Datasheet_Library/Trunk/Resistors/Yageo_Resistor_RC0402-series; Package: R0402
R44 = MCD-00185: Resistor,3K,0402,1%,1/16W; Manufacturer_Part_Number: RC0402FR-073KL; Manufacturer: YAGEO; Provided_By: SUBCO; Internal_Part_Number: MCD-00185; Status: Released; Part_Type: Resistor; ComponentLink1Description: Datasheet; ECCN_US: n/a; ECCN_EU: n/a; ComponentLink1URL: http://tunmcdsvn.tun.st.com/Component_Datasheet_Library/Trunk/Resistors/Yageo_Resistor_RC0402-series; Package: R0402
R71 R73 = MCD-00052: Resistor,0R,0402,5%,1/16W; Manufacturer_Part_Number: RC0402JR-070RL; Manufacturer: YAGEO; Provided_By: SUBCO; Initial_Board_Reference: mb1274; Internal_Part_Number: MCD-00052; ComponentLink1Description: Datasheet; ECCN_US: n/a; ECCN_EU: n/a; Status: Released; Part_Type: Resistor; ComponentLink1URL: http://tunmcdsvn.tun.st.com/Component_Datasheet_Library/Trunk/Resistors/Yageo_Resistor_RC0402-series; Package: R0402
R303 = MCD-00061: Resistor,1K,0402,1%,1/16W; Manufacturer_Part_Number: RC0402FR-071KL; Manufacturer: YAGEO; Provided_By: SUBCO; Initial_Board_Reference: mb1274; Internal_Part_Number: MCD-00061; ComponentLink1Description: Datasheet; ECCN_US: n/a; ECCN_EU: n/a; Status: Released; Part_Type: Resistor; ComponentLink1URL: http://tunmcdsvn.tun.st.com/Component_Datasheet_Library/Trunk/Resistors/Yageo_Resistor_RC0402-series; Package: R0402
R304 = MCD-00358: Resistor,10R,0402,1%,1/16W; Manufacturer_Part_Number: RC0402FR-0710RL; Manufacturer: YAGEO; Provided_By: SUBCO; Internal_Part_Number: MCD-00358; Status: Released; Part_Type: Resistor; Package: R0402; ComponentLink1Description: Datasheet; ComponentLink1URL: http://tunmcdsvn.tun.st.com/Component_Datasheet_Library/Trunk/Resistors/Yageo_Resistor_RC0402-series
SB1-SB4 SB9 SB10 = MCD-00071: Solder Bridge ON; Part_Type: Mechanical; Manufacturer: YAGEO; Manufacturer_Part_Number: RC0603JR-070RL; Provided_By: SUBCO; Initial_Board_Reference: mb1274; Internal_Part_Number: MCD-00071; ECCN_US: n/a; ECCN_EU: n/a; Status: Released; ComponentLink1Description: Datasheet; ComponentLink1URL: http://tunmcdsvn.tun.st.com/Component_Datasheet_Library/Trunk/Resistors/Yageo_Resistor_RC0603-series; Package: SB0603
SB11-SB16 = MCD-00072: Solder Bridge OFF; Part_Type: Mechanical; Manufacturer: YAGEO; Manufacturer_Part_Number: RC0603JR-070RL; Provided_By: SUBCO; Initial_Board_Reference: mb1274; Internal_Part_Number: MCD-00072; ECCN_US: n/a; ECCN_EU: n/a; Status: Released; ComponentLink1Description: Datasheet; ComponentLink1URL: http://tunmcdsvn.tun.st.com/Component_Datasheet_Library/Trunk/Resistors/Yageo_Resistor_RC0603-series; Package: SB0603
TP1-TP5 TP8 TP9 TP19 TP22 TP23 = MCD-00074: Test Point 1mm; Part_Type: Mechanical; Initial_Board_Reference: MB1274; Internal_Part_Number: MCD-00074; ECCN_US: n/a; ECCN_EU: n/a; Provided_By: n/a; Status: Released; Manufacturer_Part_Number: n/a; Manufacturer: n/a; ComponentLink1Description: Datasheet; ComponentLink1URL: http://na
TP10 TP13 TP14 = MCD-00631: Test Point 0.6mm; Part_Type: Mechanical; Initial_Board_Reference: mb1264; Internal_Part_Number: MCD-00631; Status: Released; ECCN_US: n/a; ECCN_EU: n/a; Provided_By: n/a; ComponentLink1Description: Datasheet
U13 = MCD-02020: MPU TFBGA12x12 without crypto increased frequency; Part_Type: IC; Manufacturer: STMICROELECTRONICS; Provided_By: SUBCO with ST control; ECCN_US: 3A991A2; ECCN_EU: NEC; Internal_Part_Number: MCD-02020; Status: Footprint available; Manufacturer_Part_Number: STM32MP157DAC1; ComponentLink1Description: Datasheet; ComponentLink1URL: http://tunmcdsvn.tun.st.com/Component_Datasheet_Library/Trunk/IC/STM_MPU_12x12_POA_DM00342580_POA12x12; Package: TFBGA12x12
X4 = MCD-01479: Crystal 32.768kHz, 6pF, -+20PPM, R=80K, SMD; Part_Type: Crystal_Osc; Manufacturer_Part_Number: NX2012SA 32.768KHz EXS00A-MU00527; Manufacturer: NDK; Provided_By: SUBCO; Initial_Board_Reference: MB1373; Path: ws/MCD_ApplicationBoards/Lists/MCDPARTSdatabase; Item Type: Item; Internal_Part_Number: MCD-01479; Status: Checked; Package: NX2012SA; ComponentLink1Description: Datasheet; ComponentLink1URL: http://tunmcdsvn.tun.st.com/Component_Datasheet_Library/Trunk/Crystal_Osc/NDK_NX2012SA 32.768KHz EXS00A-MU00527
X6 = MCD-01627: Oscillator 24Mhz, +-50ppm, Vcc:3.3V typ (1.62V min), square wave: [0.1Vcc;0.9Vcc], Enable pin; Part_Type: Crystal_Osc; Manufacturer_Part_Number: NZ2016SH 24MHz END4869F; Manufacturer: NDK; Provided_By: SUBCO; Internal_Part_Number: MCD-01627; Status: Footprint available; Package: 2.0x1.6x0.7mm; ComponentLink1Description: Datasheet; ComponentLink1URL: http://tunmcdsvn.tun.st.com/Component_Datasheet_Library/Trunk/Crystal_Osc/NDK_NZ2016SH 24MHz END4869F